# Altium project Hardware.PrjPcb
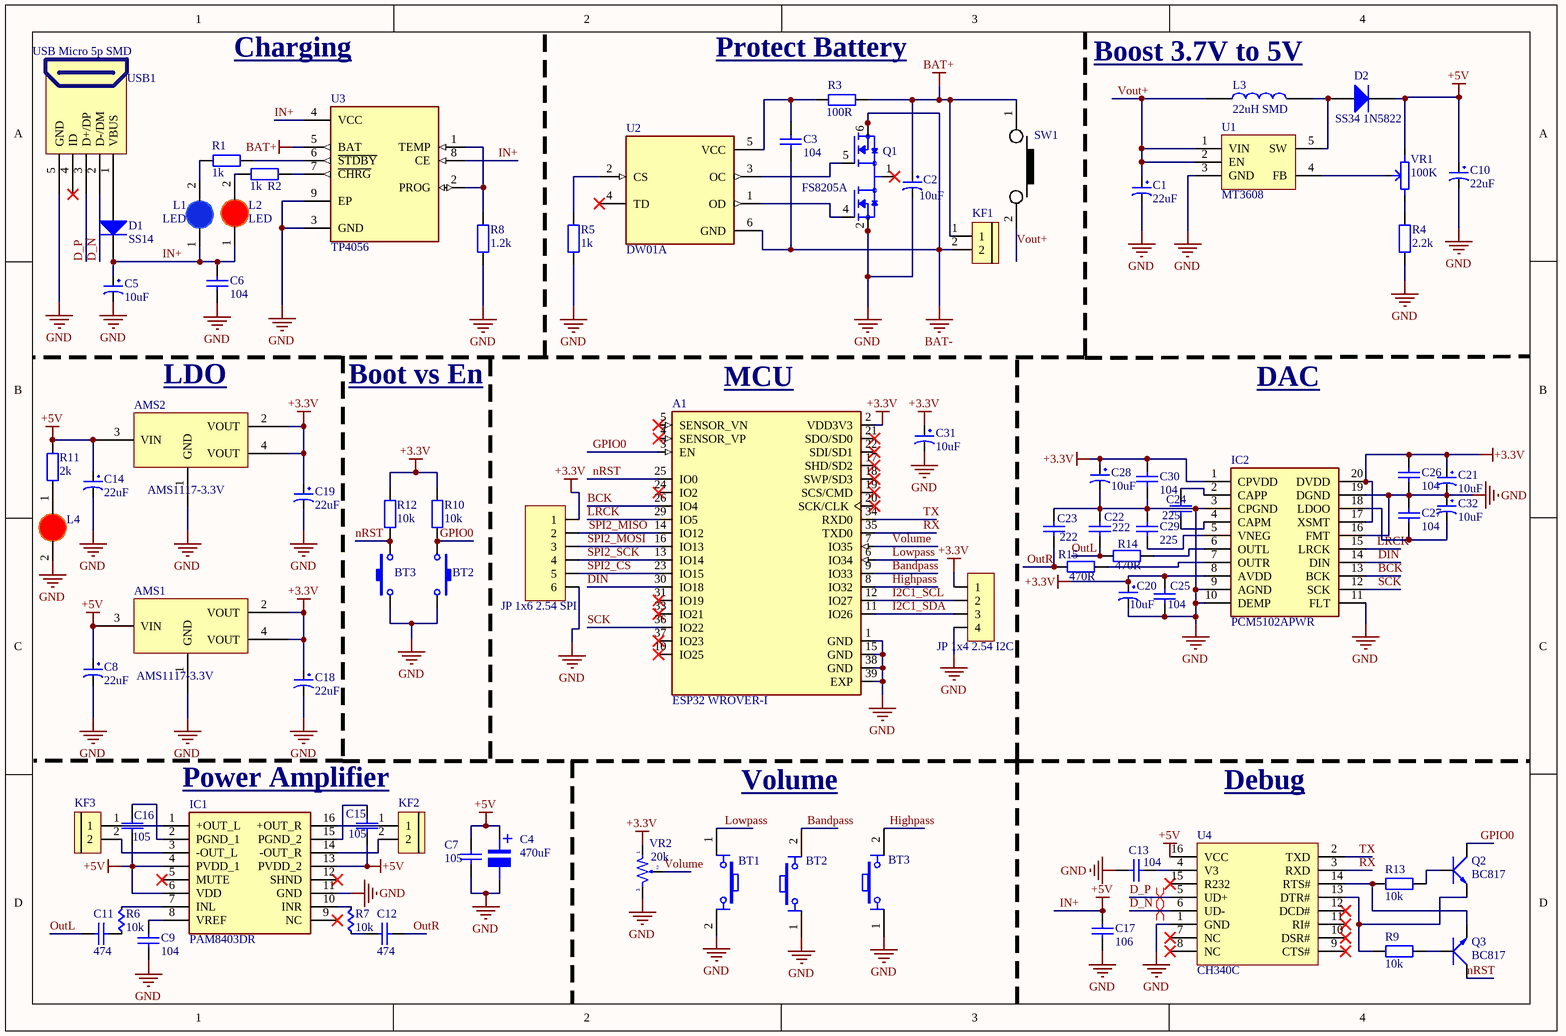
[diagram p0: main.SchDoc]
1 sheet, 79 parts. Net scope: global (net labels, ports and power ports of the same name join across sheets).
Board file: PCB.PcbDoc

## Sheet main.SchDoc
size A4; SheetNumber: 1; SheetTotal: 1

### Parts
(Parts that share a designator on the sheet are numbered #1, #2 ... from top to bottom, then left to right.)
A1  ESP32 WROVER-I  [ESP32-WROVER-I]
AMS1  AMS1117-3.3V  [SOT223]
AMS2  AMS1117-3.3V  [SOT223]
BT1  Nut Nhan 4 Chan Cam 6x6  [Nut Nhan 4 Chan Cam 6x6]  (value not drawn)
BT2#1  Nut Nhan 2 Chan SMD 3x6x2.5  [Nut Nhan 2 Chan SMD 3x6x2.5]  (value not drawn)
BT2#2  Nut Nhan 4 Chan Cam 6x6  [Nut Nhan 4 Chan Cam 6x6]  (value not drawn)
BT3#1  Nut Nhan 2 Chan SMD 3x6x2.5  [Nut Nhan 2 Chan SMD 3x6x2.5]  (value not drawn)
BT3#2  Nut Nhan 4 Chan Cam 6x6  [Nut Nhan 4 Chan Cam 6x6]  (value not drawn)
C1  22uF  [tu tantalum smd6032]
C2  10uF  [tu tantalum smd3528]
C3  104  [tu 0805]
C4  470uF  [tu nhom 8 (f)]
C5  10uF  [tu tantalum smd3528]
C6  104  [tu 0805]
C7  105  [tu 0805]
C8  22uF  [tu tantalum smd6032]
C9  104  [tu 0805]
C10  22uF  [tu tantalum smd6032]
C11  474  [tu 0805]
C12  474  [tu 0805]
C13  104  [tu 0805]
C14  22uF  [tu tantalum smd6032]
C15  105  [tu 0805]
C16  105  [tu 0805]
C17  106  [tu 0805]
C18  22uF  [tu tantalum smd6032]
C19  22uF  [tu tantalum smd6032]
C20  10uF  [tu tantalum smd3528]
C21  10uF  [tu tantalum smd3528]
C22  222  [tu 0805]
C23  222  [tu 0805]
C24  225  [tu 0805]
C25  104  [tu 0805]
C26  104  [tu 0805]
C27  104  [tu 0805]
C28  10uF  [tu tantalum smd3528]
C29  225  [tu 0805]
C30  104  [tu 0805]
C31  10uF  [tu tantalum smd3528]
C32  10uF  [tu tantalum smd3528]
D1  SS14  [DIODE SMA]
D2  SS34 1N5822  [DIODE SMA]
IC1  PAM8403DR  [SOIC127P600X126-16N]
IC2  PCM5102APWR  [SOP65P640X120-20N]
JP1  JP 1x6 2.54 SPI  [JP 1x6 CC]
JP2  JP 1x4 2.54 I2C  [JP 1x4 CC]
KF1  CON 2 KF301  [Con 2 KF301 5.08]  (value not drawn)
KF2  CON 2 KF301  [Con 2 KF301 5.08]  (value not drawn)
KF3  CON 2 KF301  [Con 2 KF301 5.08]  (value not drawn)
L1  LED  [LED-5MM-BLUE]
L2  LED  [LED-5MM-RED]
L3  22uH SMD  [Cuon Cam 7x7x5]
L4  LED 0805  [LED-0805-Red]  (value not drawn)
Q1  FS8205A  [SOP65P640X120-8N]
Q2  BC817  [SOT-23]
Q3  BC817  [SOT-23]
R1  1k  [tro smd 0805]
R2  1k  [tro smd 0805]
R3  100R  [tro smd 0805]
R4  2.2k  [tro smd 0805]
R5  1k  [tro smd 0805]
R6  10k  [RES 0805]
R7  10k  [RES 0805]
R8  1.2k  [tro smd 0805]
R9  10k  [tro smd 0805]
R10  10k  [tro smd 0805]
R11  2k  [tro smd 0805]
R12  10k  [tro smd 0805]
R13  10k  [tro smd 0805]
R14  470R  [Tro SMD 0805]
R15  470R  [Tro SMD 0805]
SW1  ROCKET SWITCH-10A  [SW_2ARS_TH]  (value not drawn)
U1  MT3608  [SOT23-5]
U2  DW01A  [SOT95P280X145-6N]
U3  TP4056  [SOP127P600X175-9N]
U4  CH340C  [SOIC16_50_284_25X90_SMT]
USB1  USB Micro 5p SMD  [USB Micro 5p SMD]
VR1  100K  [Bien Tro Tam Giac Dung]
VR2  20k  [Bien Tro Volume Don]

### Nets
+3.3V: A1.2(VDD3V3) AMS1.2(VOUT) AMS1.4(VOUT) AMS2.2(VOUT) AMS2.4(VOUT) C18.1 C19.1 C20.1 C21.1 C25.1 C26.1 C28.1 C30.1 C31.1 IC2.1(CPVDD) IC2.8(AVDD) IC2.17(XSMT) IC2.20(DVDD) JP1.1 JP2.1 R10.2 R12.2 VR2.1
BAT+: C2.1 KF1.1 R3.2 SW1.1 U3.5(BAT)
BAT-: C3.2 KF1.2 Q1.6(S2) Q1.7(S2) U2.6(GND)
GND: A1.1(GND) A1.15(GND) A1.38(GND) A1.39(EXP) AMS1.1(GND) AMS2.1(GND) BT1.2 BT2#1.2 BT2#2.1 BT3#1.1 BT3#2.1 C1.2 C2.2 C4.2 C5.2 C6.2 C7.1 C8.2 C9.2 C10.2 C13.2 C14.2 C17.2 C18.2 C19.2 C20.2 C21.2 C22.1 C23.1 C25.2 C26.2 C27.1 C28.2 C29.1 C30.2 C31.2 C32.1 IC1.11(GND) IC2.3(CPGND) IC2.9(AGND) IC2.10(DEMP) IC2.11(FLT) IC2.16(FMT) IC2.19(DGND) JP1.6 JP2.4 L4.2(K) Q1.2(S1) Q1.3(S1) R4.1 R5.1 R8.1 U1.3(GND) U3.3(GND) U3.9(EP) U4.1(GND) USB1.5(GND) VR2.3
IN+: AMS1.3(VIN) AMS2.3(VIN) C4.1 C5.1 C6.1 C7.2 C8.1 C10.1 C14.1 C15.2 C16.1 C17.1 D1.2(K) D2.2(K) IC1.4(PVDD_1) IC1.6(VDD) IC1.13(PVDD_2) L1.1(A) L2.1(A) R11.2 U3.4(VCC) U3.8(CE) U4.16(VCC) VR1.1  [also labelled +5V]
Bandpass: A1.9(IO33) BT2#2.2
BCK: A1.26(IO4) IC2.13(BCK)
D_N: U4.6(UD-) USB1.2(D-/DM)
D_P: U4.5(UD+) USB1.3(D+/DP)
DIN: A1.30(IO18) IC2.14(DIN)
GPIO0: A1.3(EN) BT2#1.1 Q2.3(C) R10.1
Highpass: A1.8(IO32) BT3#2.2
I2C1_SCL: A1.12(IO27) JP2.2
I2C1_SDA: A1.11(IO26) JP2.3
Lowpass: A1.6(IO34) BT1.1
LRCK: A1.29(IO5) IC2.15(LRCK)
nRST: A1.25(IO0) BT3#1.2 Q3.3(C) R12.1
OutL: C11.1 C22.2 R14.1
OutR: C12.1 C23.2 R15.1
RX: A1.35(TXD0) U4.3(RXD)
SCK: A1.36(IO22) IC2.12(SCK)
SPI2_CS: A1.23(IO15) JP1.5
SPI2_MISO: A1.14(IO12) JP1.2
SPI2_MOSI: A1.16(IO13) JP1.3
SPI2_SCK: A1.13(IO14) JP1.4
TX: A1.34(RXD0) U4.2(TXD)
Volume: A1.7(IO35) VR2.2
Vout+: C1.1 L3.1 SW1.2 U1.1(VIN) U1.2(EN)
NetC3_1: C3.1 R3.1 U2.5(VCC)
NetC9_1: C9.1 IC1.8(VREF)
NetC11_2: C11.2 R6.1
NetC12_2: C12.2 R7.1
NetC13_1: C13.1 U4.4(V3)
NetC15_1: C15.1 IC1.15(PGND_2)
NetC16_2: C16.2 IC1.2(PGND_1)
NetC24_1: C24.1 IC2.2(CAPP)
NetC24_2: C24.2 IC2.4(CAPM)
NetC27_2: C27.2 C32.2 IC2.18(LDOO)
NetC29_2: C29.2 IC2.5(VNEG)
NetD1_1: D1.1(A) USB1.1(VBUS)
NetD2_1: D2.1(A) L3.2 U1.5(SW)
NetIC1_1: IC1.1(+OUT_L) KF3.1
NetIC1_3: IC1.3(-OUT_L) KF3.2
NetIC1_7: IC1.7(INL) R6.2
NetIC1_10: IC1.10(INR) R7.2
NetIC1_14: IC1.14(-OUT_R) KF2.2
NetIC1_16: IC1.16(+OUT_R) KF2.1
NetIC2_6: IC2.6(OUTL) R14.2
NetIC2_7: IC2.7(OUTR) R15.2
NetL1_2: L1.2(K) R1.2
NetL2_2: L2.2(K) R2.2
NetL4_1: L4.1(A) R11.1
NetQ1_1: Q1.1(D12) Q1.8(D12)
NetQ1_4: Q1.4(G1) U2.1(OD)
NetQ1_5: Q1.5(G2) U2.3(OC)
NetQ2_1: Q2.1(B) R13.2
NetQ2_2: Q2.2(E) R9.1 U4.13(DTR#)
NetQ3_1: Q3.1(B) R9.2
NetQ3_2: Q3.2(E) R13.1 U4.14(RTS#)
NetR1_1: R1.1 U3.6(~{STDBY})
NetR2_1: R2.1 U3.7(~{CHRG})
NetR4_2: R4.2 VR1.3
NetR5_2: R5.2 U2.2(CS)
NetR8_2: R8.2 U3.1(TEMP) U3.2(PROG)
NetU1_4: U1.4(FB) VR1.2

Not connected (* = marked no-connect by the designer): A1 4(SENSOR_VP)* 5(SENSOR_VN)* 10(IO25)* 17(SHD/SD2)* 18(SWP/SD3)* 19(SCS/CMD)* 20(SCK/CLK)* 21(SDO/SD0)* 22(SDI/SD1)* 24(IO2)* 31(IO19)* 33(IO21)* 37(IO23)*; IC1 5(MUTE)* 9(NC)* 12(SHND)*; U2 4(TD)*; U4 7(NC)* 8(NC)* 9(CTS#)* 10(DSR#)* 11(RI#)* 12(DCD#)* 15(R232)*; USB1 4(ID)*

### Layout directives
differential pair: D_N, D_P

### Notes on the sheet
- Charging
- (near R3) Protect Battery
- Boost 3.7V to 5V
- (near AMS2) LDO
- Boot vs En
- (near A1) MCU
- DAC
- Power Amplifier
- Volume
- Debug
- (in symbol Tu Nhom 470uF 16V) +

### Library data of the parts
A1 = ESP32 WROVER-I: Bluetooth, WiFi 802.11b/g/n, Bluetooth v4.2 + EDR, Class 1, 2 and 3 Transceiver Module 2.4GHz ~ 2.5GHz Antenna Not Included, I-PEX Surface Mount; MF: Espressif Systems; Package: Module Espressif Systems; Availability: Unavailable; MP: ESP32-WROVER-I; Value: *; SnapEDA_Link: https://www.snapeda.com/parts/ESP32-WROVER-I/Espressif%20Systems/view-part/2298808/?ref=snap; Price: None
AMS1 AMS2 = AMS1117 SMD: Dán; Value: AMS1117-3.3V SOT223; Don_Vi: Con; Ma_Hang: MH000596; Ghi_Chu: *; Kieu_Chan: *; Chung_Loai: Dán
BT1 BT2#2 BT3#2 = Nut Nhan 4 Chan Cam 6x6: Nut Nhan 4 Chan 6x6mm; Ten: Nút Nhấn 4 Chân 6x6x5MM DIP; Ma_Hang: MH004584
BT2#1 BT3#1 = Nut Nhan 2 Chan SMD 3x6x2.5: Ma_Hang: MH001036; Ten: Nút Nhấn 2 Chân 3x6x2.5MM SMD
C1 C8 C10 C14 C18 C19 = Tu tantalum 22uF 25V SMD6032: Dán; Don_Vi: Con; So_Chan: 2; Ten_Linh_Kien: Tụ tantalum 226E-22uF 25V SMD6032; Ma_Hang: MH002651; Chung_Loai: Dán; Kieu_Chan: *
C2 C5 C20 C21 C28 C31 C32 = Tu tantalum 10uF 16V SMD3528: Dán; Don_Vi: Con; So_Chan: 2; Ten_Linh_Kien: Tụ tantalum 106C-10uF 16V SMD3528; Ma_Hang: MH007474; Chung_Loai: Dán; Kieu_Chan: *
C3 C6 C9 C13 C25-C27 C30 = Tu 0805 104 50V 10%: Dán; Don_Vi: Con; So_Chan: 2; Ten_Linh_Kien: Tụ 0805 104-100nF 10% 50V; Ma_Hang: MH004551; Chung_Loai: Dán; Kieu_Chan: *
C4 = Tu Nhom 470uF 16V: Dán; Don_Vi: Con; So_Chan: 2; Ten_Linh_Kien: Tụ Nhôm 470uF 16V 8x10.4MM; Ma_Hang: MH001940; Chung_Loai: Dán; Kieu_Chan: *
C7 C15 C16 = Tu 0805 105 50V 10%: Dán; Don_Vi: Con; So_Chan: 2; Ten_Linh_Kien: Tụ 0805 105-1uF 10% 50V; Ma_Hang: MH004552; Chung_Loai: Dán; Kieu_Chan: *
C11 C12 = Tu 0805 474 50V 10%: Dán; Don_Vi: Con; So_Chan: 2; Ten_Linh_Kien: Tụ 0805 474-470nF 50V 10%; Ma_Hang: MH006116; Chung_Loai: Dán; Kieu_Chan: *
C17 = Tu 0805 106 16V 10%: Dán; Ten_Linh_Kien: Tụ 0805 106-10uF 10% 16V; So_Chan: 2; Don_Vi: Con; Ma_Hang: MH004553; Chung_Loai: Dán; Kieu_Chan: *
C22 C23 = Tu 0805 222 50V 10%: Dán; Don_Vi: Con; So_Chan: 2; Ten_Linh_Kien: Tụ 0805 222-2.2nF 10% 50V; Ma_Hang: MH004557; Chung_Loai: Dán; Kieu_Chan: *
C24 C29 = Tu 0805 225 25V 10%: Dán; Don_Vi: Con; So_Chan: 2; Ten_Linh_Kien: Tụ 0805 225-2.2uF 25V 10%; Ma_Hang: MH007483; Chung_Loai: Dán; Kieu_Chan: *
D1 = Diode SS14 ( 1N5819): Dán; Ma_Hang: MH002211; Don_Vi: Con; Ten_Linh_Kien: Diode SS14 DO214 Schottky 1A 40V ( 1N5819 DO214); Chung_Loai: Dán; Ghi_Chu: *; Kieu_Chan: *
D2 = Diode SS34 ( 1N5822 ): Dán; Don_Vi: Con; Ma_Hang: MH002104; Ten_Linh_Kien: Diode SS34 3A 40V SMA ( 1N5822 SS34A); Kieu_Chan: *; Chung_Loai: Dán
IC1 = PAM8403DR: Integrated Circuit; Manufacturer_Name: Diodes Incorporated; Datasheet Link: https://www.diodes.com/assets/Datasheets/products_inactive_data/PAM8403.pdf; Height: 1.26mm; Manufacturer_Part_Number: PAM8403DR; Mouser Part Number: 621-PAM8403DR; Mouser Price/Stock: https://www.mouser.co.uk/ProductDetail/Diodes-Incorporated/PAM8403DR?qs=pYVYkI7xuRWy4KLk4EstIg%3D%3D; Arrow Part Number: PAM8403DR; Arrow Price/Stock: https://www.arrow.com/en/products/pam8403dr/diodes-incorporated?utm_currency=USD&region=nac
IC2 = PCM5102APWR: Integrated Circuit; Manufacturer_Name: Texas Instruments; Datasheet Link: https://componentsearchengine.com/Datasheets/2/PCM5102APWR.pdf; Height: 1.2mm; Manufacturer_Part_Number: PCM5102APWR; Mouser Part Number: 595-PCM5102APWR; Mouser Price/Stock: https://www.mouser.co.uk/ProductDetail/Texas-Instruments/PCM5102APWR?qs=E2%2FxqS9xjzrfECkwEYoiyg%3D%3D; Arrow Part Number: PCM5102APWR; Arrow Price/Stock: null?utm_currency=USD&region=nac
JP1 = JP 1x6 2.54 Cai Cong: Cắm; Ten_Linh_Kien: Jump Đơn Cái 2.54MM 1x40P Cong; Don_Vi: Con; Ma_Hang: MH001265; Ghi_Chu: *; Kieu_Chan: *; Chung_Loai: Cắm
JP2 = JP 1x4 2.54 Cai Cong: Cắm; Ten_Linh_Kien: Jump Đơn Cái 2.54MM 1x40P Cong; Don_Vi: Con; Ma_Hang: MH001265; Ghi_Chu: *; Kieu_Chan: *; Chung_Loai: Cắm
KF1-KF3 = CON 2 KF301: Cắm; Ma_Hang: MH000987; Ten_Linh_Kien: CON 2 KF301-2P 5.08MM Xanh Dương; Chung_Loai: Cắm; Ghi_Chu: *; Kieu_Chan: *; Don_Vi: Con
L1 = LED 5mm Xanh Duong: Cắm; Don_Vi: Con; Ma_Hang: MH008987; Ten_Linh_Kien: Led 5MM Xanh Dương Đục (1000c); Ghi_Chu: *; Kieu_Chan: *; Chung_Loai: Cắm
L2 = LED 5mm Do: Cắm; Don_Vi: Con; Ma_Hang: MH008967; Ten_Linh_Kien: Led 5MM Phủ Đỏ (1000c); Ghi_Chu: *; Kieu_Chan: *; Chung_Loai: Cắm
L3 = CUON CAM 47uH SMD: Dán; Don_Vi: Con; Ma_Hang: MH004211; Ten_Linh_Kien: Cuộn Cảm 47uH 7x7x4MM CD74R; Ghi_Chu: *; Kieu_Chan: *; Chung_Loai: Dán
L4 = LED 0805 Do: Dán; Don_Vi: Con; Ma_Hang: MH000897; Ten_Linh_Kien: LED 0805 Màu Đỏ (Red); Ghi_Chu: *; Kieu_Chan: *; Chung_Loai: Dán
Q1 = FS8205A: N/A; MF: Fortune Semiconductor; MP: FS8205A; Value: *; Availability: Not in stock; Package: Package; Price: None; SnapEDA_Link: https://www.snapeda.com/parts/FS8205A/Fortune+Semiconductor/view-part/?ref=snap; Check_prices: https://www.snapeda.com/parts/FS8205A/Fortune+Semiconductor/view-part/?ref=eda
Q2 Q3 = Trans BC817: SOT-23 - C8658; Value: C9014
R1 R2 = Tro 0805 5% 1k: Dán; Don_Vi: Con; So_Chan: 2; Ten_Linh_Kien: Trở 0805 5% 1k; Ma_Hang: MH005234; Chung_Loai: Dán; Kieu_Chan: *
R3 = Tro 0805 5% 100R: Dán; Don_Vi: Con; So_Chan: 2; Ten_Linh_Kien: Trở 0805 5% 100R; Ma_Hang: MH005251; Chung_Loai: Dán; Kieu_Chan: *
R4 = Tro 0805 5% 2.2k: Dán; Don_Vi: Con; So_Chan: 2; Ten_Linh_Kien: Trở 0805 5% 2.2k; Ma_Hang: MH005237; Chung_Loai: Dán; Kieu_Chan: *
R5 = Tro 0805 1% 1k: Dán; Don_Vi: Con; So_Chan: 2; Ten_Linh_Kien: Trở 0805 1% 1k; Ma_Hang: MH005468; Chung_Loai: Dán; Kieu_Chan: *
R6 R7 = RES 0805: RES SMD 0805; Manufacturer: Vishay Dale; Manufacturer Part Number: CRCW040210K0FKED; Tolerance: ±1%; Power (Watts): 0.063W, 1/16W; Temperature Coefficient: ±100ppm/°C; Supplier 1: Digi-Key; RoHS: RoHS Compliant; Category: Resistors; Stock 1: 2392462; Pricing 1: 10=0.083, 50=0.0444, 200=0.0255, 1000=0.0174 (USD); Packaging: Cut Tape (CT); Resistance (Ohms): 10k; Composition: Thick Film; Features: Automotive AEC-Q200; Operating Temperature: -55°C ~ 155°C; Package / Case: 0402 (1005 Metric); Supplier Device Package: 0402 (1005 Metric); Size / Dimension: 0.039" L x 0.020" W (1.00mm x 0.50mm); Height: 0.016" (0.40mm); Number of Terminations: 2; ComponentLink1URL: http://www.vishay.com/docs/20035/dcrcwe3.pdf; ComponentLink1Description: http://www.vishay.com/docs/20035/dcrcwe3.pdf; Supplier Part Number 1: 541-10.0KLCT-ND
R8 = Tro 0805 5% 1.2k: Dán; Don_Vi: Con; So_Chan: 2; Ten_Linh_Kien: Trở 0805 5% 1.2k; Ma_Hang: MH005231; Chung_Loai: Dán; Kieu_Chan: *
R9 R10 R12 R13 = Tro 0805 5% 10k: Dán; Don_Vi: Con; So_Chan: 2; Ten_Linh_Kien: Trở 0805 5% 10k; Ma_Hang: MH005239; Chung_Loai: Dán; Kieu_Chan: *
R11 = Tro 0805 1% 2k: Dán; Don_Vi: Con; So_Chan: 2; Ten_Linh_Kien: Trở 0805 1% 2k; Ma_Hang: MH005471; Chung_Loai: Dán; Kieu_Chan: *
R14 R15 = Tro 0805 5% 470R: Dán; Don_Vi: Con; Ma_Hang: MH005341; Ten_Linh_Kien: Trở 0805 5% 470R; So_Chan: 2; Chung_Loai: Dán; Kieu_Chan: *
SW1 = SW1_10A-SRB23A2BBBNN-TH: Rocker Switch SPDT 10A (AC) 125V Panel Mount, Snap-In; Manufacturer: ITT C&K; Alternate Part Number-1: NA; Manufacturer Part Number: SRB23A2BBBNN; Case/Package: TH; Supplier-1: SP ROAD; Supplier Part Number-1: SRB23A2BBBNN
U1 = REG_2~24-2~28V-4A-SOT23-5: The MT3608 is a constant frequency, 6-pin SOT23 / current mode step-up converter; Manufacturer: AEROSEMI; Alternate Part Number-1: NA; Manufacturer Part Number: MT3608; Case/Package: SOT-23-5; Supplier-1: NA; Supplier Part Number-1: NA
U2 = DW01A: One Cell Lithium-ion/Polymer Battery Protection IC; MF: Fortune Semiconductor; SnapEDA_Link: https://www.snapeda.com/parts/DW01A/Fortune+Semiconductor/view-part/?ref=snap; Package: SOT-23-6 Fortune Semiconductor; Value: *; MP: DW01A; Check_prices: https://www.snapeda.com/parts/DW01A/Fortune+Semiconductor/view-part/?ref=eda
U3 = TP4056: Complete single cell Li-Ion battery with a constant current / constant voltage linear charger; MF: NanJing Top Power ASIC Corp.; Check_prices: https://www.snapeda.com/parts/TP4056/NanJing+Top+Power+ASIC+Corp./view-part/?ref=eda; SnapEDA_Link: https://www.snapeda.com/parts/TP4056/NanJing+Top+Power+ASIC+Corp./view-part/?ref=snap; Price: None; Availability: Not in stock; Package: Package; MP: TP4056; Value: *
U4 = CH340C: USB Bridge, USB to UART USB 2.0 UART Interface; Manufacturer: Olimex; Alternate Part Number-1: NA; Manufacturer Part Number: CH340C; Case/Package: SOIC16; Supplier-1: LCSC; Supplier Part Number-1: C84681
USB1 = USB Micro 5p SMD: USB Type B; Ten: MicroUSB MK5P SMD; Ma_Hang: MH001020
VR1 = Bien tro tam giac 100K Dung: Cắm; Don_Vi: Con; Ten_Linh_Kien: Biến Trở Tam Giác 104-100K RM065; Ma_Hang: MH003711; Chung_Loai: Cắm; Ghi_Chu: *; Kieu_Chan: *
VR2 = Triet Ap Don 20k: Cắm; Don_Vi: Con; Ten_Linh_Kien: Triết Áp Đơn B20K; Ma_Hang: MH001418; Kieu_Chan: *; Chung_Loai: Cắm